# Altium schematic sheet cpu.SchDoc
size A3; Organization: Develer s.r.l.; Address1: via Mugellese 1/A; Address2: 50019 Campi Bisenzio; Address3: Firenze; Address4: ITALY; Revision: A; SheetNumber: 1; SheetTotal: 1
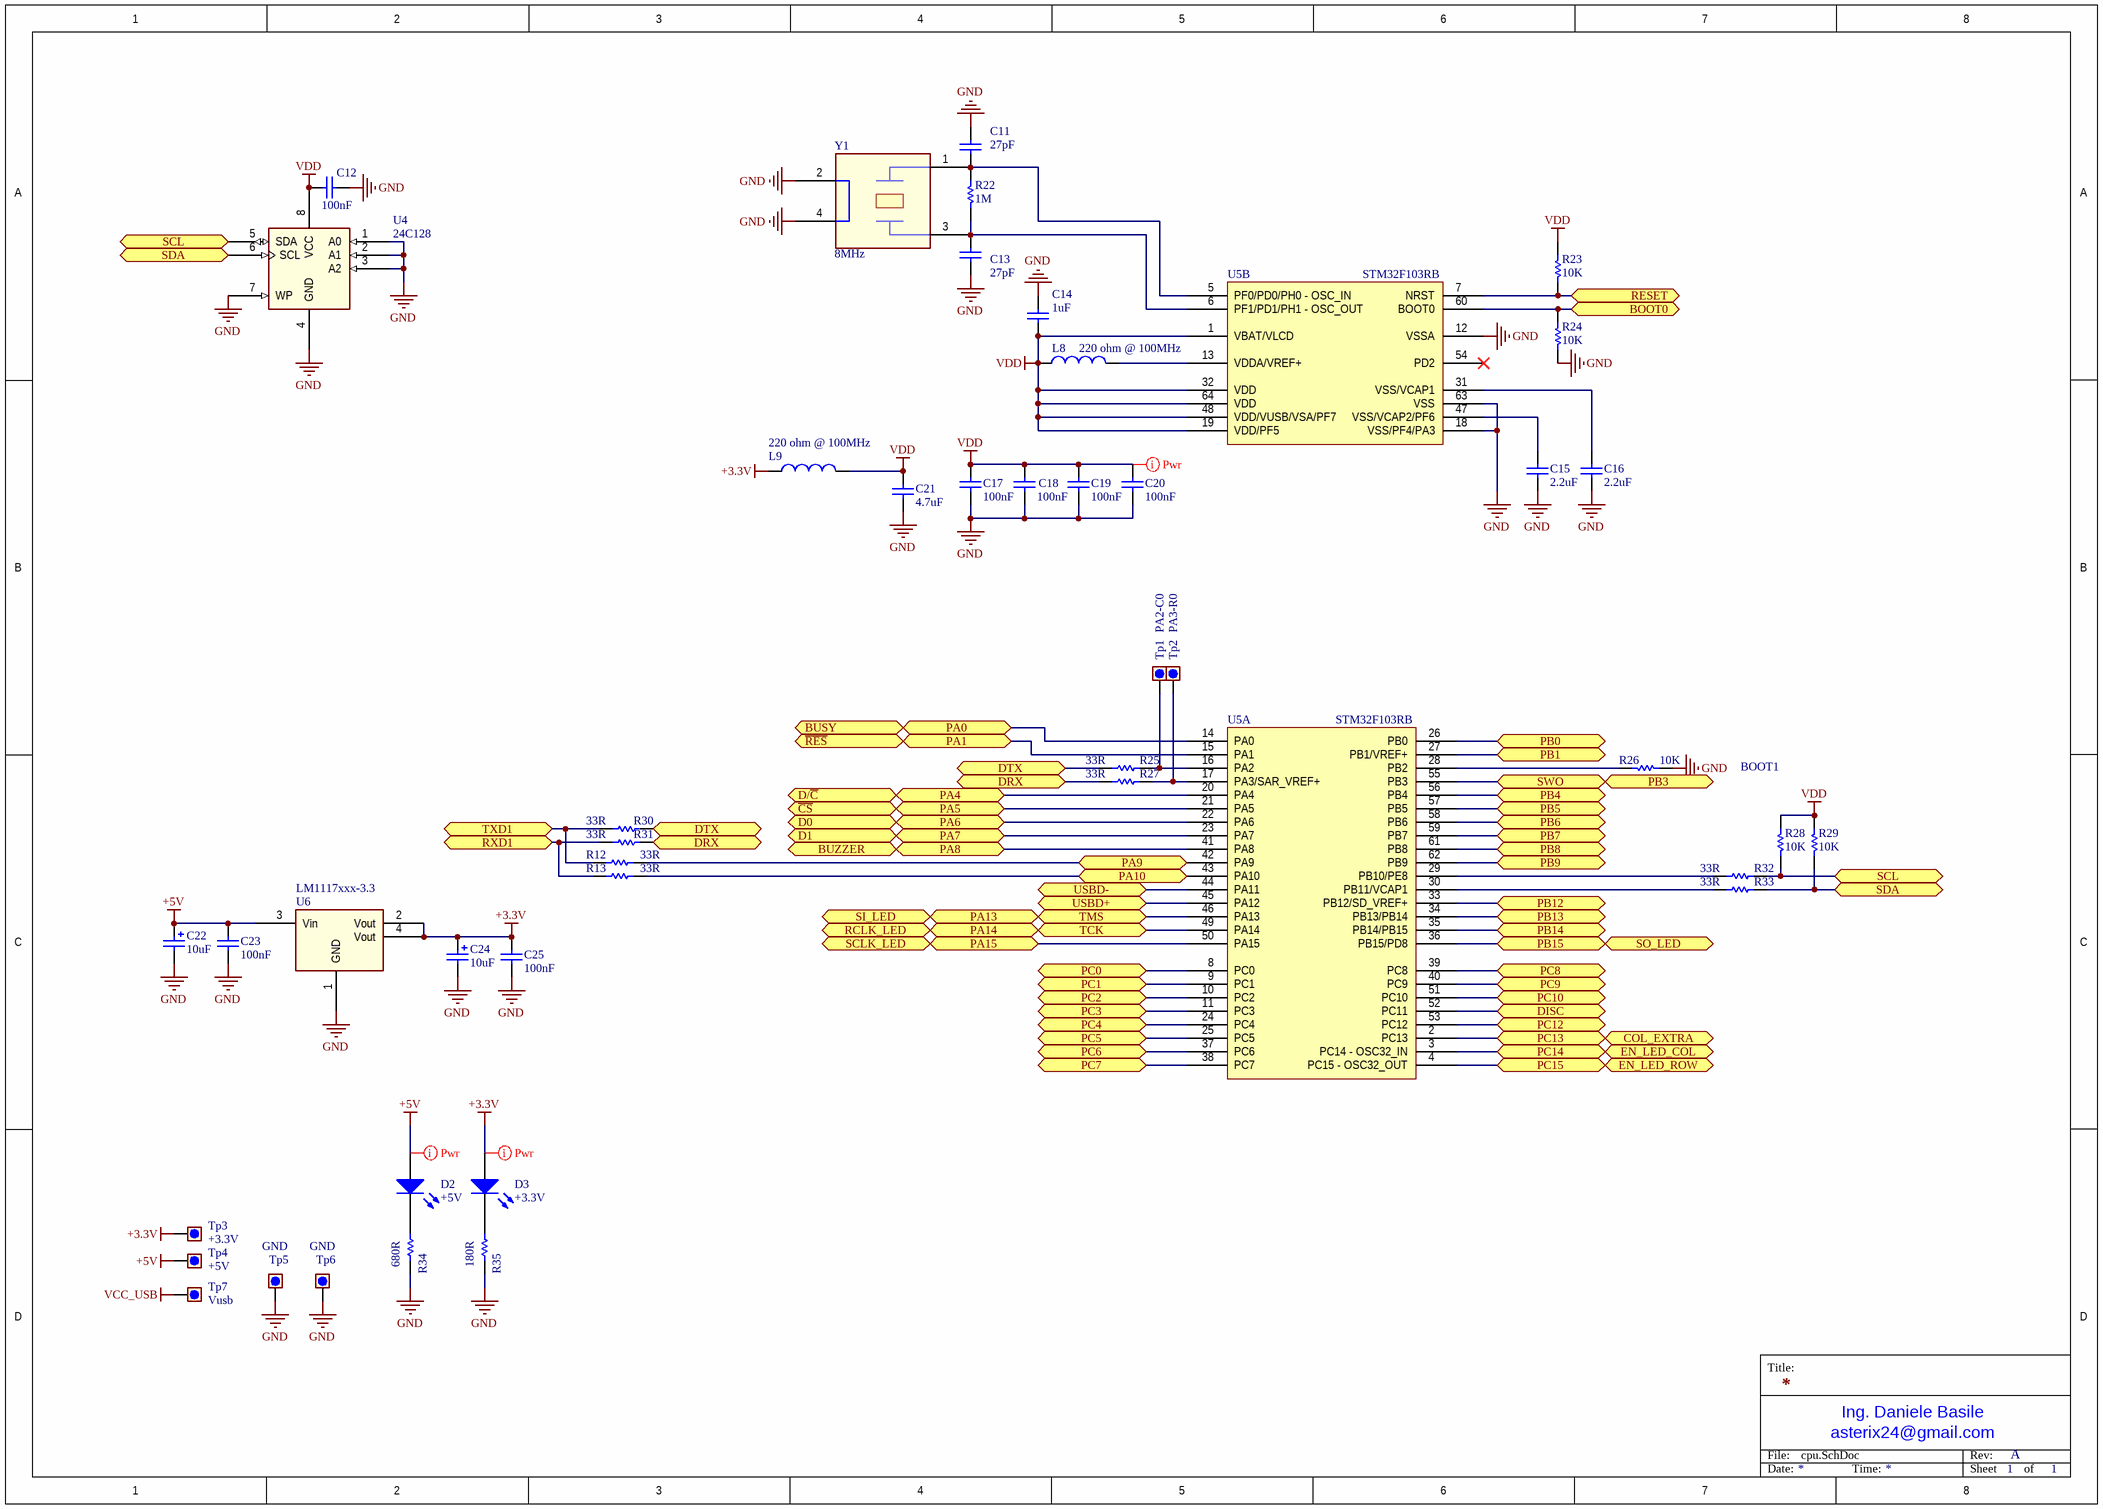
[diagram p0: cpu.SchDoc]

## Parts
C11  27pF  [0603_[1608]]
C12  100nF  [0603_[1608]]
C13  27pF  [0603_[1608]]
C14  1uF  [0603_[1608]]
C15  2.2uF  [0603_[1608]]
C16  2.2uF  [0603_[1608]]
C17  100nF  [0603_[1608]]
C18  100nF  [0603_[1608]]
C19  100nF  [0603_[1608]]
C20  100nF  [0603_[1608]]
C21  4.7uF  [0603_[1608]]
C22  10uF  [1206_[3216]]
C23  100nF  [0603_[1608]]
C24  10uF  [1206_[3216]]
C25  100nF  [0603_[1608]]
D2  +5V  [0603_[1608]_K2-A1_LED]
D3  +3.3V  [0603_[1608]_K2-A1_LED]
L8  220 ohm @ 100MHz  [0805_[2012]]
L9  220 ohm @ 100MHz  [0805_[2012]]
R12  33R  [0603_[1608]]
R13  33R  [0603_[1608]]
R22  1M  [0603_[1608]]
R23  10K  [0603_[1608]]
R24  10K  [0603_[1608]]
R25  33R  [0603_[1608]]
R26  10K  [0603_[1608]]
R27  33R  [0603_[1608]]
R28  10K  [0603_[1608]]
R29  10K  [0603_[1608]]
R30  33R  [0603_[1608]]
R31  33R  [0603_[1608]]
R32  33R  [0603_[1608]]
R33  33R  [0603_[1608]]
R34  680R  [0603_[1608]]
R35  180R  [0603_[1608]]
Tp1  PA2-C0  [TEST_POINT_THD_D1.8MM]  (no BOM)
Tp2  PA3-R0  [TEST_POINT_THD_D1.8MM]  (no BOM)
Tp3  +3.3V  [TEST_POINT_THD_D1.8MM]  (no BOM)
Tp4  +5V  [TEST_POINT_THD_D1.8MM]  (no BOM)
Tp5  GND  [TEST_POINT_THD_D1.8MM]  (no BOM)
Tp6  GND  [TEST_POINT_THD_D1.8MM]  (no BOM)
Tp7  Vusb  [TEST_POINT_THD_D1.8MM]  (no BOM)
U4  24C128  [SOIC8]
U5  STM32F103RB  [TSQFP50P1200X1200X160-64N]  (parts A,B of 2)
U6  LM1117xxx-3.3  [SOT-223]
Y1  8MHz  [CRYSTAL_3.2X2.5MM_4P_SMD]

## Ports
BOOT0, BUSY, BUZZER, COL_EXTRA, D0, D1, D/~{C}, DISC, DRX, DTX, EN_LED_COL, EN_LED_ROW, PA0, PA1, PA4, PA5, PA6, PA7, PA8, PA9, PA10, PA13, PA14, PA15, PB0, PB1, PB3, PB4, PB5, PB6, PB7, PB8, PB9, PB12, PB13, PB14, PB15, PC0, PC1, PC2, PC3, PC4, PC5, PC6, PC7, PC8, PC9, PC10, PC12, PC13, PC14, PC15, RCLK_LED, RESET, RXD1, SCL, SCLK_LED, SDA, SI_LED, SO_LED, SWO, TCK, TMS, TXD1, USBD+, USBD-, ~{CS}, ~{RES}

## Nets
+3.3V: C24.1 C25.2 D3.1(A) L9.1 Tp3.1 U6.2(Vout) U6.4(Vout)
+5V: C22.1 C23.2 D2.1(A) Tp4.1 U6.3(Vin)
GND: C11.2 C12.1 C13.2 C14.2 C15.1 C16.1 C17.2 C18.2 C19.2 C20.2 C21.1 C22.2 C23.1 C24.2 C25.1 R24.1 R26.2 R34.1 R35.1 Tp5.1 Tp6.1 U4.1(A0) U4.2(A1) U4.3(A2) U4.4(GND) U4.7(WP) U5.12(VSSA) U5.18(VSS/PF4/PA3) U5.63(VSS) U6.1(GND) Y1.2 Y1.4
VCC_USB: Tp7.1
VDD: C12.2 C14.1 C17.1 C18.1 C19.1 C20.1 C21.2 L8.1 L9.2 R23.1 R28.2 R29.2 U4.8(VCC) U5.1(VBAT/VLCD) U5.19(VDD/PF5) U5.32(VDD) U5.48(VDD/VUSB/VSA/PF7) U5.64(VDD)
BOOT0: R24.2 U5.60(BOOT0) ; port BOOT0
BUSY: U5.14(PA0) ; port PA0, port BUSY
BUZZER: U5.41(PA8) ; port PA8, port BUZZER
~{CS}: U5.21(PA5) ; port PA5, port ~{CS}
COL_EXTRA: U5.2(PC13) ; port PC13, port COL_EXTRA
D0: U5.22(PA6) ; port PA6, port D0
D1: U5.23(PA7) ; port PA7, port D1
D/~{C}: U5.20(PA4) ; port PA4, port D/~{C}
DISC: U5.52(PC11) ; port DISC
DRX: R27.2 R31.1 ; port DRX
DTX: R25.2 R30.1 ; port DTX
EN_LED_COL: U5.3(PC14_-_OSC32_IN) ; port PC14, port EN_LED_COL
EN_LED_ROW: U5.4(PC15_-_OSC32_OUT) ; port PC15, port EN_LED_ROW
PA1: U5.15(PA1) ; port PA1, port ~{RES}
PA9: R12.1 U5.42(PA9) ; port PA9
PA10: R13.1 U5.43(PA10) ; port PA10
PA13: U5.46(PA13) ; port TMS, port PA13, port SI_LED
PA14: U5.49(PA14) ; port TCK, port PA14, port RCLK_LED
PA15: U5.50(PA15) ; port PA15, port SCLK_LED
PB0: U5.26(PB0) ; port PB0
PB1: U5.27(PB1/VREF+) ; port PB1
PB3: U5.55(PB3) ; port SWO, port PB3
PB4: U5.56(PB4) ; port PB4
PB5: U5.57(PB5) ; port PB5
PB6: U5.58(PB6) ; port PB6
PB7: U5.59(PB7) ; port PB7
PB8: U5.61(PB8) ; port PB8
PB9: U5.62(PB9) ; port PB9
PB12: U5.33(PB12/SD_VREF+) ; port PB12
PB13: U5.34(PB13/PB14) ; port PB13
PB14: U5.35(PB14/PB15) ; port PB14
PB15: U5.36(PB15/PD8) ; port PB15, port SO_LED
PC0: U5.8(PC0) ; port PC0
PC1: U5.9(PC1) ; port PC1
PC2: U5.10(PC2) ; port PC2
PC3: U5.11(PC3) ; port PC3
PC4: U5.24(PC4) ; port PC4
PC5: U5.25(PC5) ; port PC5
PC6: U5.37(PC6) ; port PC6
PC7: U5.38(PC7) ; port PC7
PC8: U5.39(PC8) ; port PC8
PC9: U5.40(PC9) ; port PC9
PC10: U5.51(PC10) ; port PC10
PC12: U5.53(PC12) ; port PC12
RESET: R23.2 U5.7(NRST) ; port RESET
RXD1: R13.2 R31.2 ; port RXD1
SCL: R28.1 R32.1 U4.5(SDA) ; port SCL
SDA: R29.1 R33.1 U4.6(SCL) ; port SDA
TXD1: R12.2 R30.2 ; port TXD1
USBD+: U5.45(PA12) ; port USBD+
USBD-: U5.44(PA11) ; port USBD-
NetC11_1: C11.1 R22.2 U5.5(PF0/PD0/PH0_-_OSC_IN) Y1.1
NetC13_1: C13.1 R22.1 U5.6(PF1/PD1/PH1_-_OSC_OUT) Y1.3
NetC15_2: C15.2 U5.47(VSS/VCAP2/PF6)
NetC16_2: C16.2 U5.31(VSS/VCAP1)
NetD2_2: D2.2(K) R34.2
NetD3_2: D3.2(K) R35.2
NetL8_2: L8.2 U5.13(VDDA/VREF+)
NetR25_1: R25.1 Tp1.1 U5.16(PA2)
NetR26_1: R26.1 U5.28(PB2)
NetR27_1: R27.1 Tp2.1 U5.17(PA3/SAR_VREF+)
NetR32_2: R32.2 U5.29(PB10/PE8)
NetR33_2: R33.2 U5.30(PB11/VCAP1)

Not connected (* = marked no-connect by the designer): U5 54(PD2)*

## Layout directives
net class Power: +3.3V, +5V, VDD

## Notes on the sheet
- BOOT1
- Title:
- File:
- asterix24@gmail.com
- Ing. Daniele Basile
- Rev:
- Date:
- Time:
- Sheet
- of

## Library data of the parts
C11 C13 = Cap: Ceramic NP0 +/- 0.1; Value: 10nF; Published: 8-Jun-2000; Revision: July-2002: Re-released for DXP Platform.; Publisher: Altium Limited
C12 C17-C20 = Cap: Ceramic X7R 50V; Value: 10nF; Published: 8-Jun-2000; Revision: July-2002: Re-released for DXP Platform.; Publisher: Altium Limited
C14 C21 = Cap: Ceramic X7R 16V; Value: 10nF; Published: 8-Jun-2000; Revision: July-2002: Re-released for DXP Platform.; Publisher: Altium Limited
C15 C16 = Cap: Ceramic 6.3V X7R; Value: 10nF; Published: 8-Jun-2000; Revision: July-2002: Re-released for DXP Platform.; Publisher: Altium Limited
C22 C24 = Cap Pol1: Ceramic X5R 25V; Published: 8-Jun-2000; Revision: July-2002: Re-released for DXP Platform.; Publisher: Altium Limited; Value: 10uF
C23 C25 = Cap: Ceramic X7R 50V; Value: 100pF; Published: 8-Jun-2000; LatestRevisionDate: 17-Jul-2002; LatestRevisionNote: Re-released for DXP Platform.; PackageReference: RAD-0.3; Publisher: Altium Limited; PackageDescription: Radial Cap, Thru-Hole; 2 Leads; 0.3 in Pin Spacing
D2 D3 = LED0: LED Green; Published: 8-Jun-2000; LatestRevisionDate: 08-Jul-2005; LatestRevisionNote: Mech Layer 1 removed.; PackageReference: LED-0; Publisher: Altium Limited; PackageDescription: LED; 2 Leads
L8 = Inductor: Value: 100uH; Published: 8-Jun-2000; Revision: July-2002: Re-released for DXP Platform.; Publisher: Altium Limited
L9 = Inductor: WE 742792022
R12 R13 R22-R33 = Res1: Resistor; Value: 1K; Published: 8-Jun-2000; Revision: July-2002: Re-released for DXP Platform.; Publisher: Altium Limited
R34 R35 = Res1: Resistor; Revision: July-2002: Re-released for DXP Platform.
Tp1-Tp7 = Test_point: Test point
U4 = EEPROM-SOIC8: EEPROM
U6 = LM1117-FIXED-OUT: LM1117 LDO Fixed output
Y1 = CRYSTAL-4p